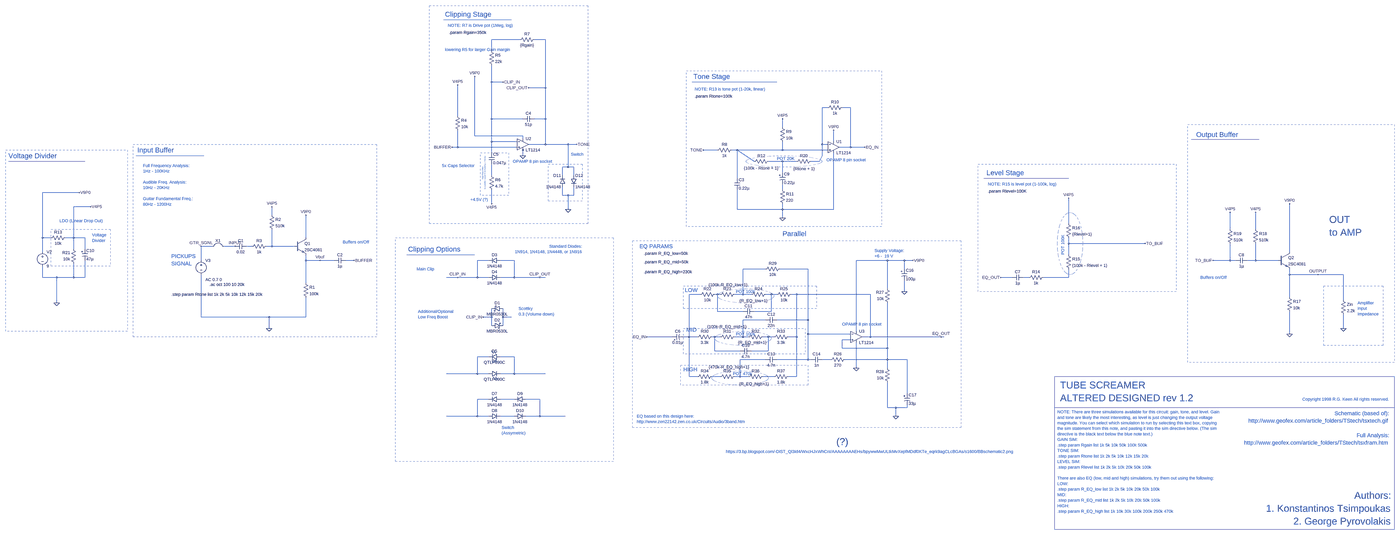
[diagram p0: schematic tube_screamer.asc, whole sheet]
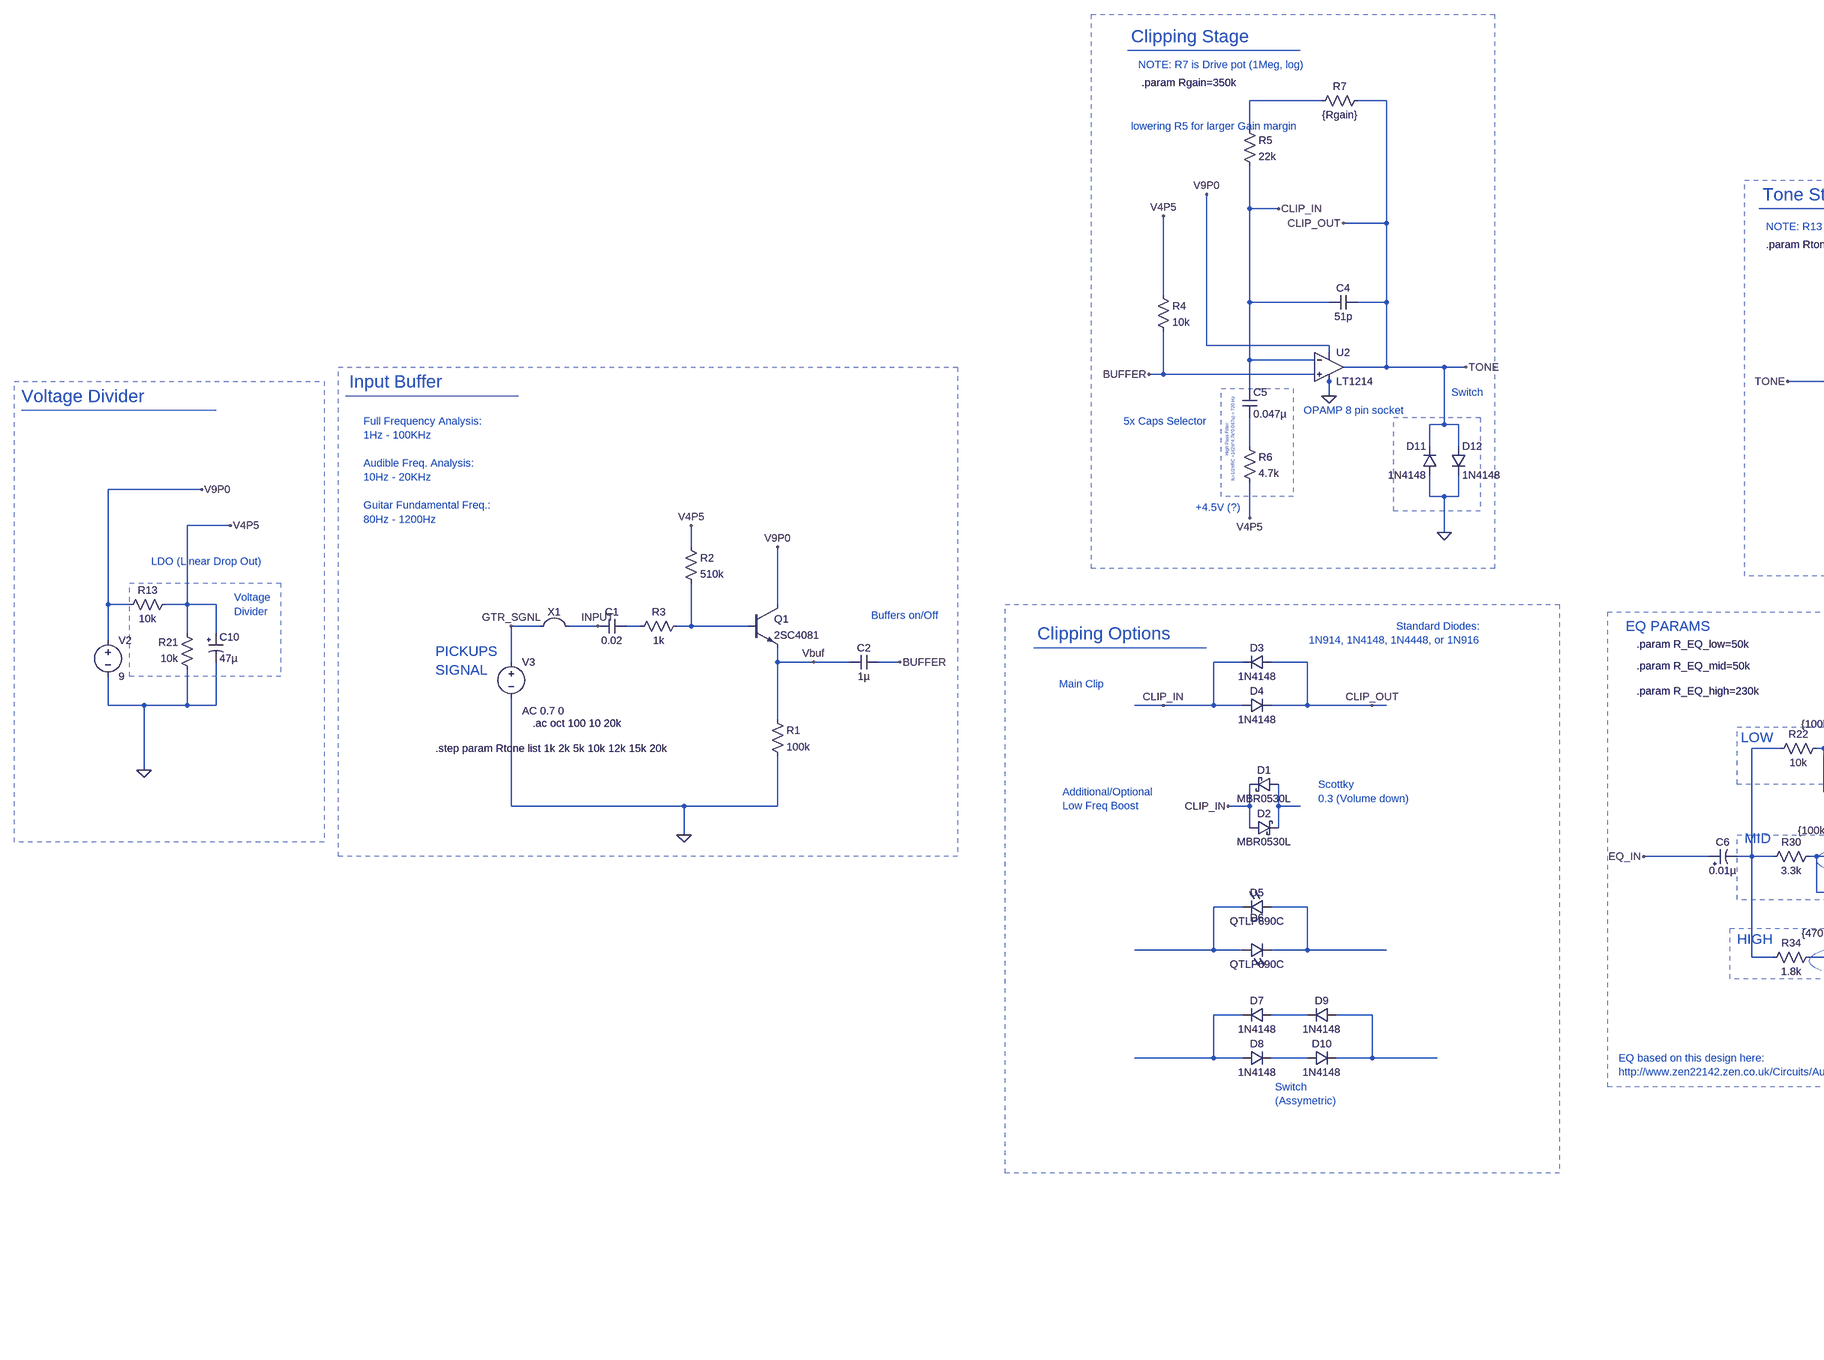
[diagram p1: schematic tube_screamer.asc, part, row 1 of 1, column 1 of 2]
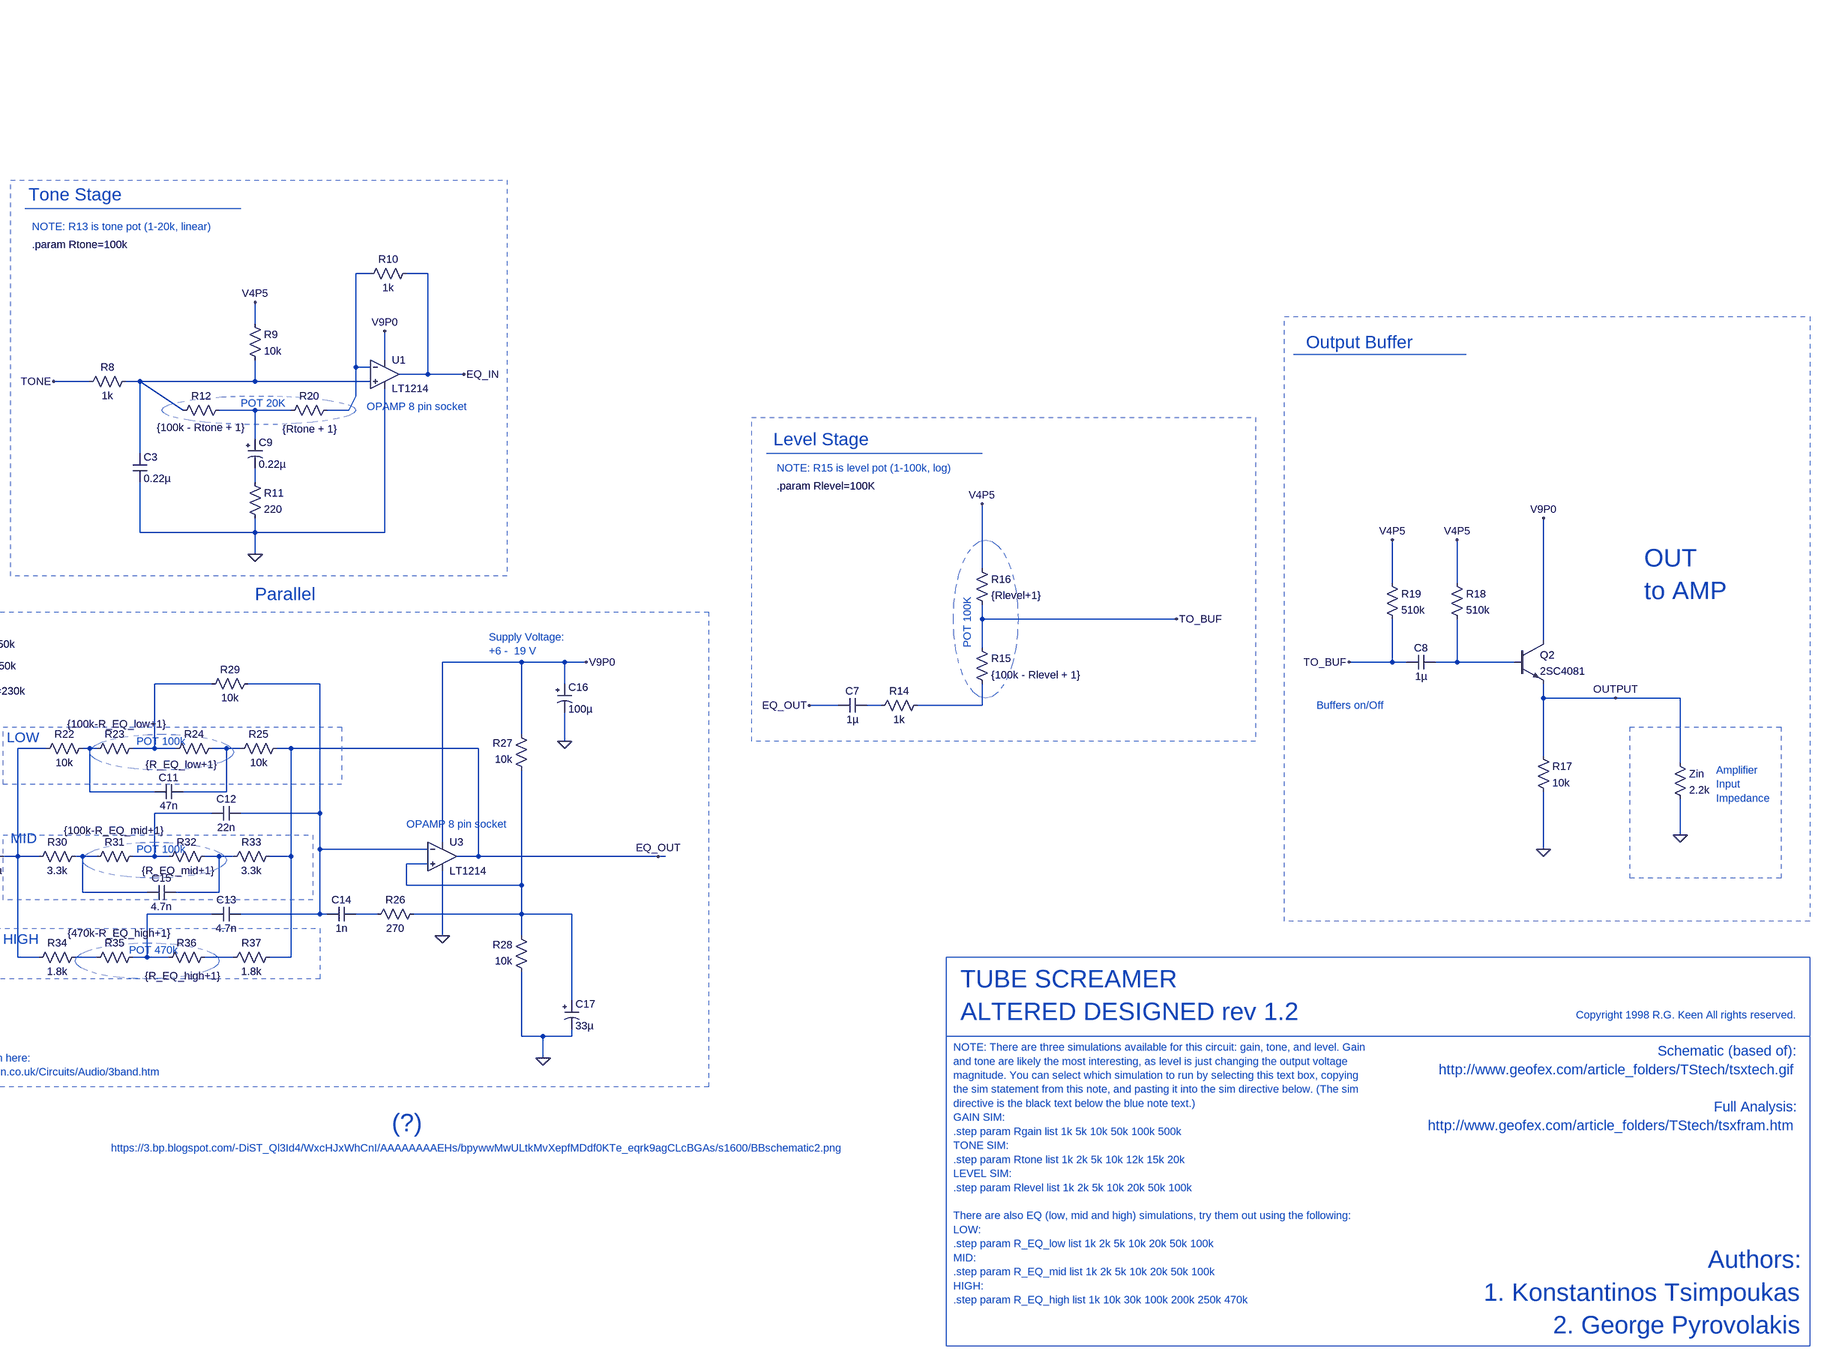
[diagram p2: schematic tube_screamer.asc, part, row 1 of 1, column 2 of 2]
tube_screamer.asc, the LTspice schematic file:
Version 4
SHEET 1 5580 4308
WIRE -2448 848 -2608 848
WIRE -2304 848 -2368 848
WIRE -2608 912 -2608 848
WIRE -2608 1088 -2608 992
WIRE -2544 1088 -2608 1088
WIRE -2304 1120 -2304 848
WIRE -2304 1120 -2400 1120
WIRE -672 1232 -704 1232
WIRE -544 1232 -592 1232
WIRE -2800 1280 -2800 1104
WIRE -2608 1296 -2608 1088
WIRE -2432 1296 -2608 1296
WIRE -2304 1296 -2304 1120
WIRE -2304 1296 -2368 1296
WIRE -928 1344 -928 1296
WIRE -2704 1392 -2704 1056
WIRE -2432 1392 -2704 1392
WIRE -2432 1408 -2432 1392
WIRE -2608 1424 -2608 1296
WIRE -2464 1424 -2608 1424
WIRE -640 1424 -640 1360
WIRE -2304 1440 -2304 1296
WIRE -2304 1440 -2400 1440
WIRE -2176 1440 -2304 1440
WIRE -2128 1440 -2176 1440
WIRE -704 1440 -704 1232
WIRE -672 1440 -704 1440
WIRE -2800 1456 -2800 1360
WIRE -2800 1456 -2832 1456
WIRE -2464 1456 -2800 1456
WIRE -544 1456 -544 1232
WIRE -544 1456 -608 1456
WIRE -464 1456 -544 1456
WIRE -2432 1472 -2432 1456
WIRE -1296 1472 -1376 1472
WIRE -1184 1472 -1216 1472
WIRE -928 1472 -928 1424
WIRE -928 1472 -1184 1472
WIRE -672 1472 -928 1472
WIRE -2608 1488 -2608 1424
WIRE -2432 1504 -2432 1472
WIRE -704 1504 -704 1440
WIRE -1088 1536 -1184 1472
WIRE -928 1536 -1008 1536
WIRE -848 1536 -928 1536
WIRE -720 1536 -704 1504
WIRE -720 1536 -768 1536
WIRE -2176 1568 -2176 1440
WIRE -2176 1568 -2208 1568
WIRE -2144 1568 -2176 1568
WIRE -928 1600 -928 1536
WIRE -2608 1616 -2608 1552
WIRE -2208 1616 -2208 1568
WIRE -2144 1616 -2144 1568
WIRE -1184 1632 -1184 1472
WIRE -928 1696 -928 1664
WIRE -4944 1712 -5152 1712
WIRE -2208 1728 -2208 1680
WIRE -2176 1728 -2208 1728
WIRE -2144 1728 -2144 1680
WIRE -2144 1728 -2176 1728
WIRE -2608 1776 -2608 1696
WIRE -4880 1792 -4976 1792
WIRE -2176 1808 -2176 1728
WIRE -1184 1808 -1184 1696
WIRE -928 1808 -928 1776
WIRE -928 1808 -1184 1808
WIRE -640 1808 -640 1488
WIRE -640 1808 -928 1808
WIRE -3856 1840 -3856 1792
WIRE -928 1856 -928 1808
WIRE 688 1888 688 1744
WIRE 1600 1920 1600 1824
WIRE 1744 1920 1744 1824
WIRE -5152 1968 -5152 1712
WIRE -5104 1968 -5152 1968
WIRE -4976 1968 -4976 1792
WIRE -4976 1968 -5024 1968
WIRE -4912 1968 -4976 1968
WIRE -3664 1968 -3664 1840
WIRE 688 2000 688 1968
WIRE 1120 2000 688 2000
WIRE -4192 2016 -4256 2016
WIRE -4064 2016 -4128 2016
WIRE -3968 2016 -4000 2016
WIRE -3856 2016 -3856 1920
WIRE -3856 2016 -3888 2016
WIRE -3728 2016 -3856 2016
WIRE -4976 2032 -4976 1968
WIRE -4912 2032 -4912 1968
WIRE -5152 2048 -5152 1968
WIRE 1936 2048 1936 1776
WIRE 688 2064 688 2000
WIRE -4256 2096 -4256 2016
WIRE -3664 2096 -3664 2064
WIRE -3584 2096 -3664 2096
WIRE -3504 2096 -3584 2096
WIRE -3392 2096 -3440 2096
WIRE -2624 2096 -2688 2096
WIRE -2480 2096 -2560 2096
WIRE -336 2096 -512 2096
WIRE -240 2096 -336 2096
WIRE -192 2096 -240 2096
WIRE 1600 2096 1600 2000
WIRE 1600 2096 1504 2096
WIRE 1632 2096 1600 2096
WIRE 1744 2096 1744 2000
WIRE 1744 2096 1696 2096
WIRE 1872 2096 1744 2096
WIRE -1024 2144 -1152 2144
WIRE -784 2144 -944 2144
WIRE -240 2144 -240 2096
WIRE 1936 2176 1936 2144
WIRE 2096 2176 1936 2176
WIRE 2240 2176 2096 2176
WIRE -5152 2192 -5152 2128
WIRE -5072 2192 -5152 2192
WIRE -4976 2192 -4976 2112
WIRE -4976 2192 -5072 2192
WIRE -4912 2192 -4912 2096
WIRE -4912 2192 -4976 2192
WIRE -2800 2192 -2864 2192
WIRE -2688 2192 -2688 2096
WIRE -2688 2192 -2800 2192
WIRE -2624 2192 -2688 2192
WIRE -2480 2192 -2480 2096
WIRE -2480 2192 -2560 2192
WIRE -2336 2192 -2480 2192
WIRE -2304 2192 -2336 2192
WIRE 368 2192 304 2192
WIRE 464 2192 432 2192
WIRE 688 2192 688 2144
WIRE 688 2192 544 2192
WIRE -3664 2224 -3664 2096
WIRE -336 2256 -336 2096
WIRE -240 2272 -240 2208
WIRE -1392 2288 -1456 2288
WIRE -1296 2288 -1312 2288
WIRE -1280 2288 -1296 2288
WIRE -1152 2288 -1152 2144
WIRE -1152 2288 -1200 2288
WIRE -1104 2288 -1152 2288
WIRE -992 2288 -1024 2288
WIRE -960 2288 -992 2288
WIRE -848 2288 -880 2288
WIRE -432 2288 -848 2288
WIRE 1936 2304 1936 2176
WIRE 2240 2320 2240 2176
WIRE -5072 2336 -5072 2192
WIRE -1296 2384 -1296 2288
WIRE -1152 2384 -1296 2384
WIRE -992 2384 -992 2288
WIRE -992 2384 -1088 2384
WIRE -4256 2416 -4256 2176
WIRE -3872 2416 -4256 2416
WIRE -3664 2416 -3664 2304
WIRE -3664 2416 -3872 2416
WIRE -2608 2416 -2608 2368
WIRE -2608 2416 -2656 2416
WIRE -2544 2416 -2544 2368
WIRE -2496 2416 -2544 2416
WIRE -1024 2432 -1152 2432
WIRE -784 2432 -784 2144
WIRE -784 2432 -960 2432
WIRE -2608 2464 -2608 2416
WIRE -2544 2464 -2544 2416
WIRE -3872 2480 -3872 2416
WIRE 2240 2480 2240 2400
WIRE -512 2496 -512 2096
WIRE -784 2512 -784 2432
WIRE -544 2512 -784 2512
WIRE 1936 2512 1936 2384
WIRE -1552 2528 -1696 2528
WIRE -1456 2528 -1456 2288
WIRE -1456 2528 -1488 2528
WIRE -1408 2528 -1456 2528
WIRE -1312 2528 -1328 2528
WIRE -1280 2528 -1312 2528
WIRE -1152 2528 -1152 2432
WIRE -1152 2528 -1200 2528
WIRE -1120 2528 -1152 2528
WIRE -1008 2528 -1040 2528
WIRE -976 2528 -1008 2528
WIRE -848 2528 -848 2288
WIRE -848 2528 -896 2528
WIRE -432 2528 -432 2288
WIRE -432 2528 -480 2528
WIRE -32 2528 -432 2528
WIRE -16 2528 -32 2528
WIRE -544 2544 -592 2544
WIRE -592 2592 -592 2544
WIRE -336 2592 -336 2336
WIRE -336 2592 -592 2592
WIRE -1312 2608 -1312 2528
WIRE -1168 2608 -1312 2608
WIRE -1008 2608 -1008 2528
WIRE -1008 2608 -1104 2608
WIRE -2624 2640 -2688 2640
WIRE -2480 2640 -2560 2640
WIRE -1024 2656 -1168 2656
WIRE -784 2656 -784 2512
WIRE -784 2656 -960 2656
WIRE -768 2656 -784 2656
WIRE -656 2656 -704 2656
WIRE -336 2656 -336 2592
WIRE -336 2656 -576 2656
WIRE -224 2656 -336 2656
WIRE -512 2704 -512 2560
WIRE -336 2704 -336 2656
WIRE -2688 2736 -2688 2640
WIRE -2688 2736 -2864 2736
WIRE -2624 2736 -2688 2736
WIRE -2480 2736 -2480 2640
WIRE -2480 2736 -2560 2736
WIRE -2304 2736 -2480 2736
WIRE -1456 2752 -1456 2528
WIRE -1408 2752 -1456 2752
WIRE -1280 2752 -1328 2752
WIRE -1168 2752 -1168 2656
WIRE -1168 2752 -1200 2752
WIRE -1120 2752 -1168 2752
WIRE -976 2752 -1040 2752
WIRE -848 2752 -848 2528
WIRE -848 2752 -896 2752
WIRE -224 2848 -224 2656
WIRE -2624 2880 -2688 2880
WIRE -2480 2880 -2560 2880
WIRE -2336 2880 -2416 2880
WIRE -336 2928 -336 2784
WIRE -288 2928 -336 2928
WIRE -224 2928 -224 2912
WIRE -224 2928 -288 2928
WIRE -2688 2976 -2688 2880
WIRE -2688 2976 -2864 2976
WIRE -2624 2976 -2688 2976
WIRE -2480 2976 -2560 2976
WIRE -2336 2976 -2336 2880
WIRE -2336 2976 -2416 2976
WIRE -2192 2976 -2336 2976
WIRE -288 2976 -288 2928
FLAG -3872 2480 0
FLAG -3584 2096 Vbuf
FLAG -2128 1440 TONE
FLAG -4944 1712 V9P0
FLAG -3664 1840 V9P0
FLAG -2704 1056 V9P0
FLAG -4880 1792 V4P5
FLAG -3856 1792 V4P5
FLAG -2800 1104 V4P5
FLAG -640 1360 V9P0
FLAG -928 1296 V4P5
FLAG 688 1744 V4P5
FLAG 1936 2512 0
FLAG 1936 1776 V9P0
FLAG 1744 1824 V4P5
FLAG 1600 1824 V4P5
FLAG -5072 2336 0
FLAG -3392 2096 BUFFER
FLAG -2832 1456 BUFFER
FLAG -1376 1472 TONE
FLAG -2432 1504 0
FLAG -928 1856 0
FLAG -464 1456 EQ_IN
FLAG 304 2192 EQ_OUT
FLAG 1120 2000 TO_BUF
FLAG 1504 2096 TO_BUF
FLAG -2544 1088 CLIP_IN
FLAG -2336 2192 CLIP_OUT
FLAG -2800 2192 CLIP_IN
FLAG -512 2704 0
FLAG -288 2976 0
FLAG -240 2272 0
FLAG -32 2528 EQ_OUT
FLAG -1696 2528 EQ_IN
FLAG -4256 2016 GTR_SGNL
FLAG -4064 2016 INPUT
FLAG 2096 2176 OUTPUT
FLAG 2240 2480 0
FLAG -192 2096 V9P0
FLAG -2400 1120 CLIP_OUT
FLAG -2656 2416 CLIP_IN
FLAG -2176 1808 0
FLAG -2608 1776 V4P5
SYMBOL npn -3728 1968 R0
SYMATTR InstName Q1
SYMATTR Value 2SC4081
SYMBOL res -3680 2208 R0
SYMATTR InstName R1
SYMATTR Value 100k
SYMBOL res -3872 1824 R0
SYMATTR InstName R2
SYMATTR Value 510k
SYMBOL res -3872 2000 R90
WINDOW 0 0 56 VBottom 2
WINDOW 3 32 56 VTop 2
SYMATTR InstName R3
SYMATTR Value 1k
SYMBOL cap -4000 2000 R90
WINDOW 0 0 32 VBottom 2
WINDOW 3 32 32 VTop 2
SYMATTR InstName C1
SYMATTR Value 0.02
SYMBOL cap -3440 2080 R90
WINDOW 0 0 32 VBottom 2
WINDOW 3 32 32 VTop 2
SYMATTR InstName C2
SYMATTR Value 1µ
SYMBOL voltage -5152 2032 R0
WINDOW 123 0 0 Left 0
SYMATTR InstName V2
SYMATTR Value 9
SYMATTR SpiceLine Rser=0
SYMBOL voltage -4256 2080 R0
WINDOW 123 24 124 Left 2
WINDOW 39 0 0 Left 0
WINDOW 3 24 44 Left 2
SYMATTR Value2 AC 0.7 0
SYMATTR Value ""
SYMATTR InstName V3
SYMBOL res -2816 1264 R0
SYMATTR InstName R4
SYMATTR Value 10k
SYMBOL res -2624 896 R0
SYMATTR InstName R5
SYMATTR Value 22k
SYMBOL res -2624 1600 R0
SYMATTR InstName R6
SYMATTR Value 4.7k
SYMBOL cap -2624 1488 R0
SYMATTR InstName C5
SYMATTR Value 0.047µ
SYMBOL res -2352 832 R90
WINDOW 0 0 56 VBottom 2
WINDOW 3 32 56 VTop 2
SYMATTR InstName R7
SYMATTR Value {Rgain}
SYMBOL Opamps/LT1214 -2432 1376 R0
SYMATTR InstName U2
SYMBOL res -1200 1456 R90
WINDOW 0 0 56 VBottom 2
WINDOW 3 32 56 VTop 2
SYMATTR InstName R8
SYMATTR Value 1k
SYMBOL cap -1200 1632 R0
SYMATTR InstName C3
SYMATTR Value 0.22µ
SYMBOL res -944 1328 R0
SYMATTR InstName R9
SYMATTR Value 10k
SYMBOL Opamps/LT1214 -640 1392 R0
SYMATTR InstName U1
SYMBOL res -576 1216 R90
WINDOW 0 0 56 VBottom 2
WINDOW 3 32 56 VTop 2
SYMATTR InstName R10
SYMATTR Value 1k
SYMBOL res -944 1680 R0
SYMATTR InstName R11
SYMATTR Value 220
SYMBOL res -992 1520 R90
WINDOW 0 0 56 VBottom 2
WINDOW 3 39 56 VTop 2
SYMATTR InstName R12
SYMATTR Value {100k - Rtone + 1}
SYMBOL cap 368 2208 R270
WINDOW 0 32 32 VTop 2
WINDOW 3 0 32 VBottom 2
SYMATTR InstName C7
SYMATTR Value 1µ
SYMBOL res 448 2208 R270
WINDOW 0 32 56 VTop 2
WINDOW 3 0 56 VBottom 2
SYMATTR InstName R14
SYMATTR Value 1k
SYMBOL res 672 2048 R0
SYMATTR InstName R15
SYMATTR Value {100k - Rlevel + 1}
SYMBOL res 672 1872 R0
SYMATTR InstName R16
SYMATTR Value {Rlevel+1}
SYMBOL npn 1872 2048 R0
SYMATTR InstName Q2
SYMATTR Value 2SC4081
SYMBOL res 1920 2288 R0
SYMATTR InstName R17
SYMATTR Value 10k
SYMBOL res 1728 1904 R0
SYMATTR InstName R18
SYMATTR Value 510k
SYMBOL cap 1696 2080 R90
WINDOW 0 0 32 VBottom 2
WINDOW 3 32 32 VTop 2
SYMATTR InstName C8
SYMATTR Value 1µ
SYMBOL res 1584 1904 R0
SYMATTR InstName R19
SYMATTR Value 510k
SYMBOL res -752 1520 R90
WINDOW 0 0 56 VBottom 2
WINDOW 3 42 54 VTop 2
SYMATTR InstName R20
SYMATTR Value {Rtone + 1}
SYMBOL res -5008 1952 R90
WINDOW 0 0 56 VBottom 2
WINDOW 3 32 56 VTop 2
SYMATTR InstName R13
SYMATTR Value 10k
SYMBOL res -4960 2128 R180
WINDOW 0 36 76 Left 2
WINDOW 3 36 40 Left 2
SYMATTR InstName R21
SYMATTR Value 10k
SYMBOL polcap -4928 2032 R0
SYMATTR InstName C10
SYMATTR Value 47µ
SYMATTR SpiceLine V=6.3
SYMBOL polcap -944 1600 R0
SYMATTR InstName C9
SYMATTR Value 0.22µ
SYMATTR SpiceLine V=35V
SYMBOL diode -2560 2080 R90
WINDOW 0 0 32 VBottom 2
WINDOW 3 32 32 VTop 2
SYMATTR InstName D3
SYMATTR Value 1N4148
SYMBOL diode -2624 2208 R270
WINDOW 0 32 32 VTop 2
WINDOW 3 0 32 VBottom 2
SYMATTR InstName D4
SYMATTR Value 1N4148
SYMBOL cap -2368 1280 R90
WINDOW 0 0 32 VBottom 2
WINDOW 3 32 32 VTop 2
SYMATTR InstName C4
SYMATTR Value 51p
SYMBOL Opamps\\LT1214 -512 2464 R0
SYMATTR InstName U3
SYMBOL res -1296 2272 R90
WINDOW 0 0 56 VBottom 2
WINDOW 3 32 56 VTop 2
SYMATTR InstName R22
SYMATTR Value 10k
SYMBOL res -1184 2272 R90
WINDOW 0 0 56 VBottom 2
WINDOW 3 -54 52 VTop 2
SYMATTR InstName R23
SYMATTR Value {100k-R_EQ_low+1}
SYMBOL res -1008 2272 R90
WINDOW 0 0 56 VBottom 2
WINDOW 3 36 84 VTop 2
SYMATTR InstName R24
SYMATTR Value {R_EQ_low+1}
SYMBOL res -864 2272 R90
WINDOW 0 0 56 VBottom 2
WINDOW 3 32 56 VTop 2
SYMATTR InstName R25
SYMATTR Value 10k
SYMBOL res -560 2640 R90
WINDOW 0 0 56 VBottom 2
WINDOW 3 32 56 VTop 2
SYMATTR InstName R26
SYMATTR Value 270
SYMBOL res -320 2352 R180
WINDOW 0 36 76 Left 2
WINDOW 3 36 40 Left 2
SYMATTR InstName R27
SYMATTR Value 10k
SYMBOL res -320 2800 R180
WINDOW 0 36 76 Left 2
WINDOW 3 36 40 Left 2
SYMATTR InstName R28
SYMATTR Value 10k
SYMBOL res -1040 2160 R270
WINDOW 0 32 56 VTop 2
WINDOW 3 0 56 VBottom 2
SYMATTR InstName R29
SYMATTR Value 10k
SYMBOL res -1312 2512 R90
WINDOW 0 0 56 VBottom 2
WINDOW 3 32 56 VTop 2
SYMATTR InstName R30
SYMATTR Value 3.3k
SYMBOL res -1184 2512 R90
WINDOW 0 0 56 VBottom 2
WINDOW 3 -57 58 VTop 2
SYMATTR InstName R31
SYMATTR Value {100k-R_EQ_mid+1}
SYMBOL res -1024 2512 R90
WINDOW 0 0 56 VBottom 2
WINDOW 3 32 75 VTop 2
SYMATTR InstName R32
SYMATTR Value {R_EQ_mid+1}
SYMBOL res -880 2512 R90
WINDOW 0 0 56 VBottom 2
WINDOW 3 32 56 VTop 2
SYMATTR InstName R33
SYMATTR Value 3.3k
SYMBOL res -1312 2736 R90
WINDOW 0 0 56 VBottom 2
WINDOW 3 32 56 VTop 2
SYMATTR InstName R34
SYMATTR Value 1.8k
SYMBOL res -1184 2736 R90
WINDOW 0 0 56 VBottom 2
WINDOW 3 -53 46 VTop 2
SYMATTR InstName R35
SYMATTR Value {470k-R_EQ_high+1}
SYMBOL res -1024 2736 R90
WINDOW 0 0 56 VBottom 2
WINDOW 3 42 65 VTop 2
SYMATTR InstName R36
SYMATTR Value {R_EQ_high+1}
SYMBOL res -880 2736 R90
WINDOW 0 0 56 VBottom 2
WINDOW 3 32 56 VTop 2
SYMATTR InstName R37
SYMATTR Value 1.8k
SYMBOL polcap -1552 2544 R270
WINDOW 0 32 32 VTop 2
WINDOW 3 0 32 VBottom 2
SYMATTR InstName C6
SYMATTR Value 0.01µ
SYMBOL polcap -256 2144 R0
SYMATTR InstName C16
SYMATTR Value 100µ
SYMBOL polcap -240 2848 R0
SYMATTR InstName C17
SYMATTR Value 33µ
SYMBOL res 2224 2304 R0
SYMATTR InstName Zin
SYMATTR Value 2.2k
SYMBOL Misc\\jumper -4160 1952 R0
SYMATTR InstName X1
SYMBOL cap -1088 2368 R90
WINDOW 0 0 32 VBottom 2
WINDOW 3 32 32 VTop 2
SYMATTR InstName C11
SYMATTR Value 47n
SYMBOL cap -960 2416 R90
WINDOW 0 0 32 VBottom 2
WINDOW 3 32 32 VTop 2
SYMATTR InstName C12
SYMATTR Value 22n
SYMBOL cap -960 2640 R90
WINDOW 0 0 32 VBottom 2
WINDOW 3 32 32 VTop 2
SYMATTR InstName C13
SYMATTR Value 4.7n
SYMBOL cap -704 2640 R90
WINDOW 0 0 32 VBottom 2
WINDOW 3 32 32 VTop 2
SYMATTR InstName C14
SYMATTR Value 1n
SYMBOL cap -1104 2592 R90
WINDOW 0 0 32 VBottom 2
WINDOW 3 32 32 VTop 2
SYMATTR InstName C15
SYMATTR Value 4.7n
SYMBOL schottky -2544 2352 R90
WINDOW 0 0 32 VBottom 2
WINDOW 3 32 32 VTop 2
SYMATTR InstName D1
SYMATTR Value MBR0530L
SYMATTR Description Diode
SYMATTR Type diode
SYMBOL schottky -2608 2480 R270
WINDOW 0 32 32 VTop 2
WINDOW 3 0 32 VBottom 2
SYMATTR InstName D2
SYMATTR Value MBR0530L
SYMATTR Description Diode
SYMATTR Type diode
SYMBOL LED -2560 2624 R90
WINDOW 0 0 32 VBottom 2
WINDOW 3 32 32 VTop 2
SYMATTR InstName D5
SYMATTR Value QTLP690C
SYMATTR Description Diode
SYMATTR Type diode
SYMBOL LED -2624 2752 R270
WINDOW 0 72 32 VTop 2
WINDOW 3 0 32 VBottom 2
SYMATTR InstName D6
SYMATTR Value QTLP690C
SYMATTR Description Diode
SYMATTR Type diode
SYMBOL diode -2560 2864 R90
WINDOW 0 0 32 VBottom 2
WINDOW 3 32 32 VTop 2
SYMATTR InstName D7
SYMATTR Value 1N4148
SYMBOL diode -2624 2992 R270
WINDOW 0 32 32 VTop 2
WINDOW 3 0 32 VBottom 2
SYMATTR InstName D8
SYMATTR Value 1N4148
SYMBOL diode -2416 2864 R90
WINDOW 0 0 32 VBottom 2
WINDOW 3 32 32 VTop 2
SYMATTR InstName D9
SYMATTR Value 1N4148
SYMBOL diode -2480 2992 R270
WINDOW 0 32 32 VTop 2
WINDOW 3 0 32 VBottom 2
SYMATTR InstName D10
SYMATTR Value 1N4148
SYMBOL diode -2192 1680 R180
WINDOW 0 24 64 Left 2
WINDOW 3 24 0 Left 2
SYMATTR InstName D11
SYMATTR Value 1N4148
SYMBOL diode -2160 1616 R0
SYMATTR InstName D12
SYMATTR Value 1N4148
TEXT -4616 1472 Left 4 ;Input Buffer
TEXT -2872 704 Left 4 ;Clipping Stage
TEXT -2856 768 Left 2 ;NOTE: R7 is Drive pot (1Meg, log)
TEXT -2848 808 Left 2 !.param Rgain=350k
TEXT -1432 1056 Left 4 ;Tone Stage
TEXT -1424 1128 Left 2 ;NOTE: R13 is tone pot (1-20k, linear)
TEXT -1424 1168 Left 2 !.param Rtone=100k
TEXT 232 1664 Left 2 ;NOTE: R15 is level pot (1-100k, log)
TEXT 232 1704 Left 2 !.param Rlevel=100K
TEXT 1408 1384 Left 4 ;Output Buffer
TEXT 624 2952 Left 2 ;NOTE: There are three simulations available for this circuit: gain, tone, and level. Gain \nand tone are likely the most interesting, as level is just changing the output voltage \nmagnitude. You can select which simulation to run by selecting this text box, copying \nthe sim statement from this note, and pasting it into the sim directive below. (The sim \ndirective is the black text below the blue note text.)\nGAIN SIM:\n.step param Rgain list 1k 5k 10k 50k 100k 500k\nTONE SIM:\n.step param Rtone list 1k 2k 5k 10k 12k 15k 20k\nLEVEL SIM:\n.step param Rlevel list 1k 2k 5k 10k 20k 50k 100k\n \nThere are also EQ (low, mid and high) simulations, try them out using the following:\nLOW: \n.step param R_EQ_low list 1k 2k 5k 10k 20k 50k 100k\nMID:\n.step param R_EQ_mid list 1k 2k 5k 10k 20k 50k 100k\nHIGH:\n.step param R_EQ_high list 1k 10k 30k 100k 200k 250k 470k
TEXT -5344 1504 Left 4 ;Voltage Divider
TEXT -4424 2072 Left 3 ;PICKUPS\nSIGNAL
TEXT 2504 2960 Right 3 ;Schematic (based of):\nhttp://www.geofex.com/article_folders/TStech/tsxtech.gif\n \nFull Analysis:\nhttp://www.geofex.com/article_folders/TStech/tsxfram.htm
TEXT 2160 1864 Left 5 ;OUT\nto AMP
TEXT 224 1600 Left 4 ;Level Stage
TEXT 640 2800 Left 5 ;TUBE SCREAMER \nALTERED DESIGNED rev 1.2
TEXT 2512 3424 Right 5 ;Authors:\n1. Konstantinos Tsimpoukas\n2. George Pyrovolakis
TEXT -4208 2232 Left 2 !.ac oct 100 10 20k
TEXT -3080 2032 Left 4 ;Clipping Options
TEXT -2096 2016 Right 2 ;Standard Diodes:\n1N914, 1N4148, 1N4448, or 1N916
TEXT 656 2064 VLeft 2 ;POT 100K
TEXT -960 1520 Left 2 ;POT 20K
TEXT -2664 1600 VTop 0 ;High Pass Filter:\nfc=1/2πRC =1/(2π*4.7k*0.047u) = 720 Hz
TEXT -1192 2272 Left 2 ;POT 100k
TEXT -1192 2512 Left 2 ;POT 100k
TEXT -1208 2736 Left 2 ;POT 470k
TEXT -1712 2056 Left 2 !.param R_EQ_low=50k
TEXT -1712 2104 Left 2 !.param R_EQ_mid=50k
TEXT -1712 2160 Left 2 !.param R_EQ_high=230k
TEXT 2320 2336 Left 2 ;Amplifier\nInput\nImpedance
TEXT -408 2040 Left 2 ;Supply Voltage: \n+6 -  19 V
TEXT -4424 2288 Left 2 !.step param Rtone list 1k 2k 5k 10k 12k 15k 20k
TEXT -1736 2016 Left 3 ;EQ PARAMS
TEXT -1480 2264 Left 3 ;LOW
TEXT -1472 2488 Left 3 ;MID
TEXT -1488 2712 Left 3 ;HIGH
TEXT -1752 2976 Left 2 ;EQ based on this design here:\nhttp://www.zen22142.zen.co.uk/Circuits/Audio/3band.htm
TEXT -4872 1952 Left 2 ;Voltage \nDivider
TEXT -4584 1560 Left 2 ;Full Frequency Analysis:\n1Hz - 100KHz\n \nAudible Freq. Analysis:\n10Hz - 20KHz\n \nGuitar Fundamental Freq.:\n80Hz - 1200Hz
TEXT -3032 2144 Left 2 ;Main Clip
TEXT -3024 2384 Left 2 ;Additional/Optional\nLow Freq Boost
TEXT 2008 2880 Left 2 ;Copyright 1998 R.G. Keen All rights reserved.
TEXT -2728 1752 Left 2 ;+4.5V (?)
TEXT -2888 1560 Left 2 ;5x Caps Selector
TEXT -2872 904 Left 2 ;lowering R5 for larger Gain margin
TEXT -3456 1992 Left 2 ;Buffers on/Off
TEXT 1432 2192 Left 2 ;Buffers on/Off
TEXT -928 1944 Left 4 ;Parallel
TEXT -5056 1872 Left 2 ;LDO (Linear Drop Out)
TEXT -624 3120 Left 5 ;(?)
TEXT -1248 3176 Left 2 ;https://3.bp.blogspot.com/-DiST_Ql3Id4/WxcHJxWhCnI/AAAAAAAAEHs/bpywwMwULtkMvXepfMDdf0KTe_eqrk9agCLcBGAs/s1600/BBschematic2.png
TEXT -2488 1536 Left 2 ;OPAMP 8 pin socket
TEXT -680 1528 Left 2 ;OPAMP 8 pin socket
TEXT -592 2456 Left 2 ;OPAMP 8 pin socket
TEXT -2552 3040 Left 2 ;Switch\n(Assymetric)
TEXT -2160 1496 Left 2 ;Switch
TEXT -2456 2368 Left 2 ;Scottky\n0.3 (Volume down)
LINE Normal 1380 1412 1764 1412
LINE Normal -2496 736 -2880 736
LINE Normal -4240 1504 -4624 1504
LINE Normal -960 1088 -1440 1088
LINE Normal -4912 1536 -5344 1536
LINE Normal 688 1632 208 1632
LINE Normal -2704 2064 -3088 2064
LINE Normal 2528 2928 608 2928
RECTANGLE Normal -4672 2496 -5360 1472 1
RECTANGLE Normal -3264 2528 -4640 1440 1
RECTANGLE Normal -2064 1888 -2960 656 1
RECTANGLE Normal -368 1904 -1472 1024 1
RECTANGLE Normal 1296 2272 176 1552 1
RECTANGLE Normal 2528 2672 1360 1328 1
RECTANGLE Normal -2512 1728 -2672 1488 1
RECTANGLE Normal 80 3040 -1776 1984 1
RECTANGLE Normal 2464 2576 2128 2240 2
RECTANGLE Normal -736 2368 -1488 2240 4
RECTANGLE Normal -800 2624 -1488 2480 4
RECTANGLE Normal -784 2800 -1504 2688 4
RECTANGLE Normal 2528 3616 608 2752
RECTANGLE Normal -4768 2128 -5104 1920 2
RECTANGLE Normal -1920 3232 -3152 1968 1
RECTANGLE Normal -2096 1760 -2288 1552 2
CIRCLE Normal 768 2176 624 1824 1
CIRCLE Normal -704 1568 -1136 1504 1
CIRCLE Normal -976 2336 -1296 2256 2
CIRCLE Normal -992 2576 -1312 2496 2
CIRCLE Normal -1008 2800 -1328 2720 2

The netlist it stands for:
* tube_screamer.asc
Q1 V9P0 N008 Vbuf 0 2SC4081
R1 Vbuf 0 100k
R2 V4P5 N008 510k
R3 N008 N007 1k
C1 N007 INPUT 0.02
C2 BUFFER Vbuf 1µ
V2 V9P0 0 9 Rser=0
V3 INPUT 0 AC 0.7 0
R4 V4P5 BUFFER 10k
R5 N001 CLIP_IN 22k
R6 N005 V4P5 4.7k
C5 CLIP_IN N005 0.047µ
R7 CLIP_OUT N001 {Rgain}
XU2 BUFFER CLIP_IN V9P0 0 CLIP_OUT LT1213  ; LT1214, pins In+ In- V+ V- OUT
R8 N003 CLIP_OUT 1k
C3 N003 0 0.22µ
R9 V4P5 N003 10k
XU1 N003 N002 V9P0 0 EQ_IN LT1213  ; LT1214, pins In+ In- V+ V- OUT
R10 EQ_IN N002 1k
R11 N006 0 220
R12 N004 N003 {100k - Rtone + 1}
C7 EQ_OUT N012 1µ
R14 N012 N013 1k
R15 TO_BUF N013 {100k - Rlevel + 1}
R16 V4P5 TO_BUF {Rlevel+1}
Q2 V9P0 N009 OUTPUT 0 2SC4081
R17 OUTPUT 0 10k
R18 V4P5 N009 510k
C8 N009 TO_BUF 1µ
R19 V4P5 TO_BUF 510k
R20 N002 N004 {Rtone + 1}
R13 V4P5 V9P0 10k
R21 0 V4P5 10k
C10 V4P5 0 47µ V=6.3
C9 N004 N006 0.22µ V=35V
D3 CLIP_OUT CLIP_IN 1N4148
D4 CLIP_IN CLIP_OUT 1N4148
C4 CLIP_OUT CLIP_IN 51p
XU3 N021 N011 V9P0 0 EQ_OUT LT1213  ; LT1214, pins In+ In- V+ V- OUT
R22 N015 N014 10k
R23 N010 N015 {100k-R_EQ_low+1}
R24 N016 N010 {R_EQ_low+1}
R25 EQ_OUT N016 10k
R26 N021 N025 270
R27 N021 V9P0 10k
R28 0 N021 10k
R29 N010 N011 10k
R30 N019 N014 3.3k
R31 N018 N019 {100k-R_EQ_mid+1}
R32 N020 N018 {R_EQ_mid+1}
R33 EQ_OUT N020 3.3k
R34 N026 N014 1.8k
R35 N024 N026 {470k-R_EQ_high+1}
R36 N027 N024 {R_EQ_high+1}
R37 EQ_OUT N027 1.8k
C6 EQ_IN N014 0.01µ
C16 V9P0 0 100µ
C17 N021 0 33µ
R§Zin OUTPUT 0 2.2k
C11 N016 N015 47n
C12 N011 N018 22n
C13 N011 N024 4.7n
C14 N025 N011 1n
C15 N020 N019 4.7n
D1 N017 CLIP_IN MBR0530L
D2 CLIP_IN N017 MBR0530L
D5 N023 N022 QTLP690C
D6 N022 N023 QTLP690C
D7 N029 N028 1N4148
D8 N028 N031 1N4148
D9 N030 N029 1N4148
D10 N031 N030 1N4148
D11 0 CLIP_OUT 1N4148
D12 CLIP_OUT 0 1N4148
.model D D
.lib standard.dio
.model NPN NPN
.model PNP PNP
.lib standard.bjt
* Input Buffer
* Clipping Stage
* NOTE: R7 is Drive pot (1Meg, log)
.param Rgain=350k
* Tone Stage
* NOTE: R13 is tone pot (1-20k, linear)
.param Rtone=100k
* NOTE: R15 is level pot (1-100k, log)
.param Rlevel=100K
* Output Buffer
* NOTE: There are three simulations available for this circuit: gain, tone, and level. Gain
* and tone are likely the most interesting, as level is just changing the output voltage
* magnitude. You can select which simulation to run by selecting this text box, copying
* the sim statement from this note, and pasting it into the sim directive below. (The sim
* directive is the black text below the blue note text.)
* GAIN SIM:
* .step param Rgain list 1k 5k 10k 50k 100k 500k
* TONE SIM:
* .step param Rtone list 1k 2k 5k 10k 12k 15k 20k
* LEVEL SIM:
* .step param Rlevel list 1k 2k 5k 10k 20k 50k 100k
* There are also EQ (low, mid and high) simulations, try them out using the following:
* LOW:
* .step param R_EQ_low list 1k 2k 5k 10k 20k 50k 100k
* MID:
* .step param R_EQ_mid list 1k 2k 5k 10k 20k 50k 100k
* HIGH:
* .step param R_EQ_high list 1k 10k 30k 100k 200k 250k 470k
* Voltage Divider
* PICKUPS
* SIGNAL
* Schematic (based of):
* http://www.geofex.com/article_folders/TStech/tsxtech.gif
* Full Analysis:
* http://www.geofex.com/article_folders/TStech/tsxfram.htm
* OUT
* to AMP
* Level Stage
* TUBE SCREAMER
* ALTERED DESIGNED rev 1.2
* Authors:
* 1. Konstantinos Tsimpoukas
* 2. George Pyrovolakis
.ac oct 100 10 20k
* Clipping Options
* Standard Diodes:
* 1N914, 1N4148, 1N4448, or 1N916
* POT 100K
* POT 20K
* High Pass Filter:
* fc=1/2πRC =1/(2π*4.7k*0.047u) = 720 Hz
* POT 100k
* POT 100k
* POT 470k
.param R_EQ_low=50k
.param R_EQ_mid=50k
.param R_EQ_high=230k
* Amplifier
* Input
* Impedance
* Supply Voltage:
* +6 -  19 V
.step param Rtone list 1k 2k 5k 10k 12k 15k 20k
* EQ PARAMS
* LOW
* MID
* HIGH
* EQ based on this design here:
* http://www.zen22142.zen.co.uk/Circuits/Audio/3band.htm
* Voltage
* Divider
* Full Frequency Analysis:
* 1Hz - 100KHz
* Audible Freq. Analysis:
* 10Hz - 20KHz
* Guitar Fundamental Freq.:
* 80Hz - 1200Hz
* Main Clip
* Additional/Optional
* Low Freq Boost
* Copyright 1998 R.G. Keen All rights reserved.
* +4.5V (?)
* 5x Caps Selector
* lowering R5 for larger Gain margin
* Buffers on/Off
* Buffers on/Off
* Parallel
* LDO (Linear Drop Out)
* (?)
* https://3.bp.blogspot.com/-DiST_Ql3Id4/WxcHJxWhCnI/AAAAAAAAEHs/bpywwMwULtkMvXepfMDdf0KTe_eqrk9agCLcBGAs/s1600/BBschematic2.png
* OPAMP 8 pin socket
* OPAMP 8 pin socket
* OPAMP 8 pin socket
* Switch
* (Assymetric)
* Switch
* Scottky
* 0.3 (Volume down)
.lib LTC.lib
.backanno
.end